# EAGLE schematic Light_Module (EAGLE 6.4)

## Sheet 1 of 2
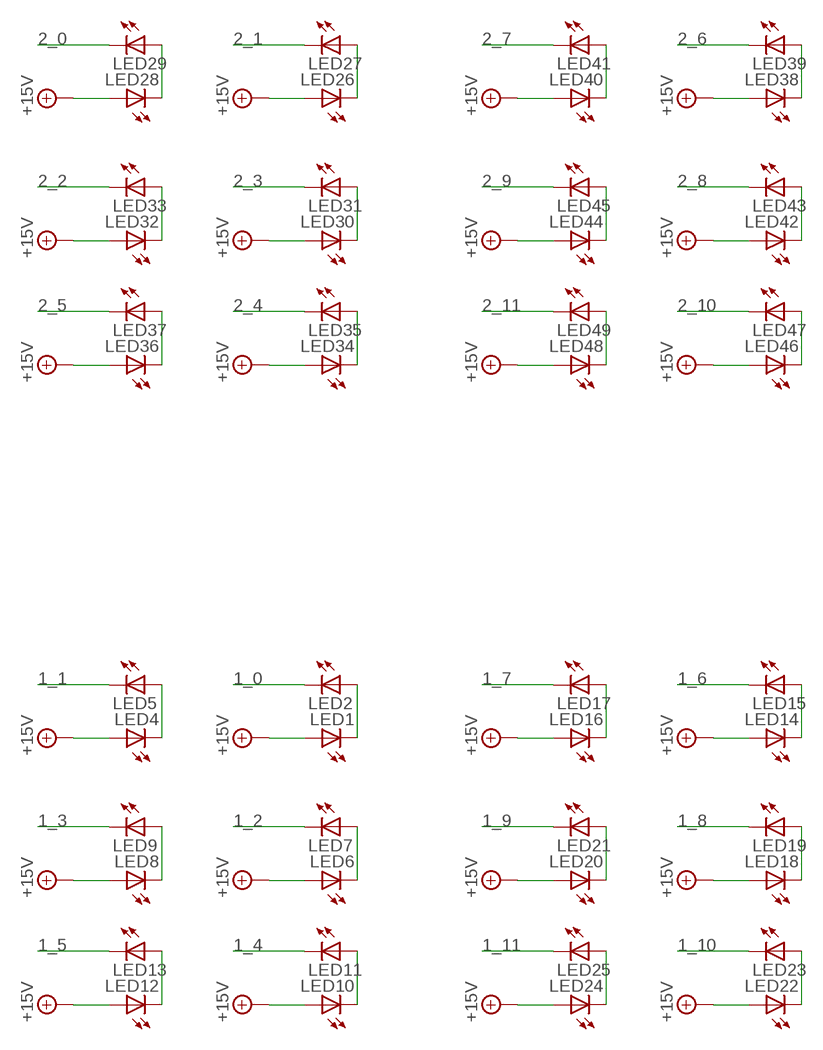
[diagram p0: schematic, sheet 1]

### Parts
LED1  LED  [DS205]
LED2  LED  [DS205]
LED4  LED  [DS205]
LED5  LED  [DS205]
LED6  LED  [DS205]
LED7  LED  [DS205]
LED8  LED  [DS205]
LED9  LED  [DS205]
LED10  LED  [DS205]
LED11  LED  [DS205]
LED12  LED  [DS205]
LED13  LED  [DS205]
LED14  LED  [DS205]
LED15  LED  [DS205]
LED16  LED  [DS205]
LED17  LED  [DS205]
LED18  LED  [DS205]
LED19  LED  [DS205]
LED20  LED  [DS205]
LED21  LED  [DS205]
LED22  LED  [DS205]
LED23  LED  [DS205]
LED24  LED  [DS205]
LED25  LED  [DS205]
LED26  LED  [DS205]
LED27  LED  [DS205]
LED28  LED  [DS205]
LED29  LED  [DS205]
LED30  LED  [DS205]
LED31  LED  [DS205]
LED32  LED  [DS205]
LED33  LED  [DS205]
LED34  LED  [DS205]
LED35  LED  [DS205]
LED36  LED  [DS205]
LED37  LED  [DS205]
LED38  LED  [DS205]
LED39  LED  [DS205]
LED40  LED  [DS205]
LED41  LED  [DS205]
LED42  LED  [DS205]
LED43  LED  [DS205]
LED44  LED  [DS205]
LED45  LED  [DS205]
LED46  LED  [DS205]
LED47  LED  [DS205]
LED48  LED  [DS205]
LED49  LED  [DS205]

### Nets
1_0: LED2.P$2(C) ; also sheet 2
1_1: LED5.P$2(C) ; also sheet 2
1_2: LED7.P$2(C) ; also sheet 2
1_3: LED9.P$2(C) ; also sheet 2
1_4: LED11.P$2(C) ; also sheet 2
1_5: LED13.P$2(C) ; also sheet 2
1_6: LED15.P$2(C) ; also sheet 2
1_7: LED17.P$2(C) ; also sheet 2
1_8: LED19.P$2(C) ; also sheet 2
1_9: LED21.P$2(C) ; also sheet 2
1_10: LED23.P$2(C) ; also sheet 2
1_11: LED25.P$2(C) ; also sheet 2
2_0: LED29.P$2(C) ; also sheet 2
2_1: LED27.P$2(C) ; also sheet 2
2_2: LED33.P$2(C) ; also sheet 2
2_3: LED31.P$2(C) ; also sheet 2
2_4: LED35.P$2(C) ; also sheet 2
2_5: LED37.P$2(C) ; also sheet 2
2_6: LED39.P$2(C) ; also sheet 2
2_7: LED41.P$2(C) ; also sheet 2
2_8: LED43.P$2(C) ; also sheet 2
2_9: LED45.P$2(C) ; also sheet 2
2_10: LED47.P$2(C) ; also sheet 2
2_11: LED49.P$2(C) ; also sheet 2
+15V: LED1.P$1(A) LED4.P$1(A) LED6.P$1(A) LED8.P$1(A) LED10.P$1(A) LED12.P$1(A) LED14.P$1(A) LED16.P$1(A) LED18.P$1(A) LED20.P$1(A) LED22.P$1(A) LED24.P$1(A) LED26.P$1(A) LED28.P$1(A) LED30.P$1(A) LED32.P$1(A) LED34.P$1(A) LED36.P$1(A) LED38.P$1(A) LED40.P$1(A) LED42.P$1(A) LED44.P$1(A) LED46.P$1(A) LED48.P$1(A) ; also sheet 2
N$5: LED1.P$2(C) LED2.P$1(A)
N$9: LED4.P$2(C) LED5.P$1(A)
N$10: LED6.P$2(C) LED7.P$1(A)
N$11: LED8.P$2(C) LED9.P$1(A)
N$12: LED10.P$2(C) LED11.P$1(A)
N$13: LED12.P$2(C) LED13.P$1(A)
N$14: LED14.P$2(C) LED15.P$1(A)
N$15: LED16.P$2(C) LED17.P$1(A)
N$16: LED18.P$2(C) LED19.P$1(A)
N$17: LED20.P$2(C) LED21.P$1(A)
N$18: LED22.P$2(C) LED23.P$1(A)
N$19: LED24.P$2(C) LED25.P$1(A)
N$20: LED26.P$2(C) LED27.P$1(A)
N$21: LED28.P$2(C) LED29.P$1(A)
N$22: LED30.P$2(C) LED31.P$1(A)
N$23: LED32.P$2(C) LED33.P$1(A)
N$24: LED34.P$2(C) LED35.P$1(A)
N$25: LED36.P$2(C) LED37.P$1(A)
N$26: LED38.P$2(C) LED39.P$1(A)
N$27: LED40.P$2(C) LED41.P$1(A)
N$28: LED42.P$2(C) LED43.P$1(A)
N$29: LED44.P$2(C) LED45.P$1(A)
N$30: LED46.P$2(C) LED47.P$1(A)
N$31: LED48.P$2(C) LED49.P$1(A)

## Sheet 2 of 2
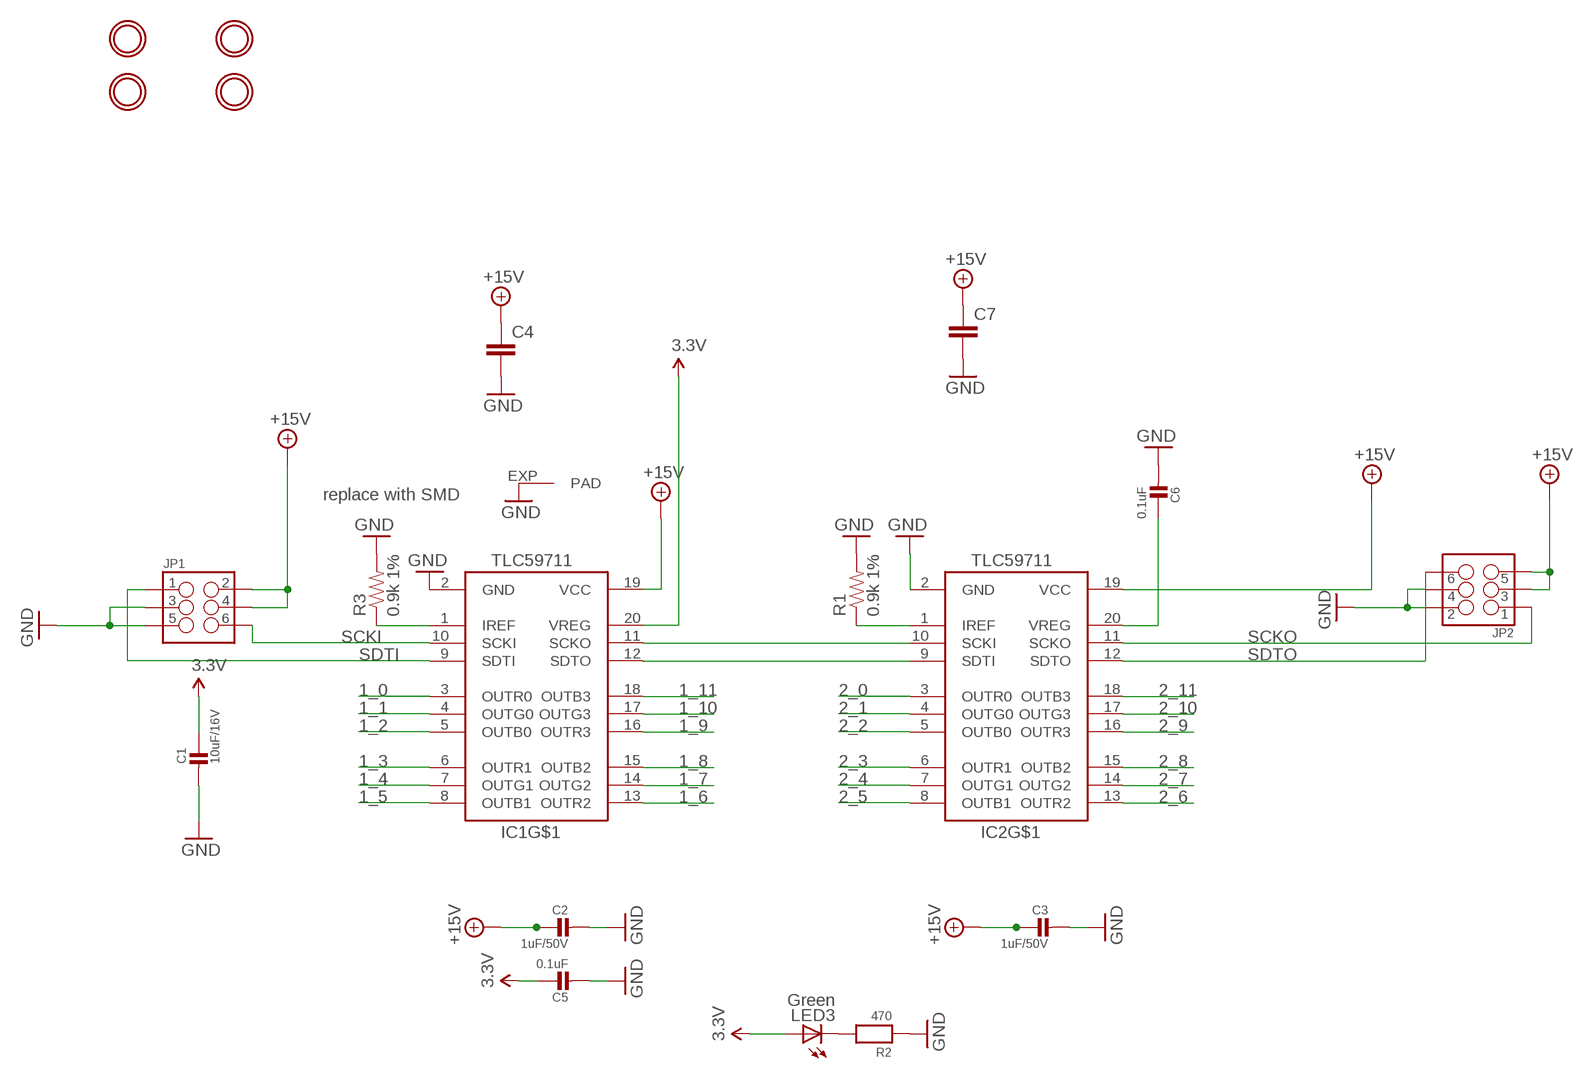
[diagram p1: schematic, sheet 2]

### Parts
C1  10uF/16V  CAP_CERAMIC0805  [0805]
C2  1uF/50V  CAP_CERAMIC0805  [0805]
C3  1uF/50V  CAP_CERAMIC0805  [0805]
C4  CAP1206  [1206]
C5  0.1uF  CAP_CERAMIC0805  [0805]
C6  0.1uF  CAP_CERAMIC0805  [0805]
C7  CAP_  [AXIAL-5MM]
IC1  TLC59711  [HTSSOP20DAP]
IC2  TLC59711  [HTSSOP20DAP]
JP1  M03X2FEMALE_SMD  [2X3_SMD]
JP2  M03X2FEMALE_SMD  [2X3_SMD]
LED3  Green  LEDCHIP-LED0805  [CHIP-LED0805]
R1  0.9k 1%  RESISTOR1206  [1206]
R2  470  RESISTOR0805  [0805]
R3  0.9k 1%  RESISTOR1206  [1206]
U$1  MOUNTINGHOLE2.5  [MOUNTINGHOLE_2.5_PLATED]
U$2  MOUNTINGHOLE2.5  [MOUNTINGHOLE_2.5_PLATED]
U$3  MOUNTINGHOLE2.5  [MOUNTINGHOLE_2.5_PLATED]
U$4  MOUNTINGHOLE2.5  [MOUNTINGHOLE_2.5_PLATED]

### Nets
1_0: IC1.3(OUTR0) ; also sheet 1
1_1: IC1.4(OUTG0) ; also sheet 1
1_2: IC1.5(OUTB0) ; also sheet 1
1_3: IC1.6(OUTR1) ; also sheet 1
1_4: IC1.7(OUTG1) ; also sheet 1
1_5: IC1.8(OUTB1) ; also sheet 1
1_6: IC1.13(OUTR2) ; also sheet 1
1_7: IC1.14(OUTG2) ; also sheet 1
1_8: IC1.15(OUTB2) ; also sheet 1
1_9: IC1.16(OUTR3) ; also sheet 1
1_10: IC1.17(OUTG3) ; also sheet 1
1_11: IC1.18(OUTB3) ; also sheet 1
2_0: IC2.3(OUTR0) ; also sheet 1
2_1: IC2.4(OUTG0) ; also sheet 1
2_2: IC2.5(OUTB0) ; also sheet 1
2_3: IC2.6(OUTR1) ; also sheet 1
2_4: IC2.7(OUTG1) ; also sheet 1
2_5: IC2.8(OUTB1) ; also sheet 1
2_6: IC2.13(OUTR2) ; also sheet 1
2_7: IC2.14(OUTG2) ; also sheet 1
2_8: IC2.15(OUTB2) ; also sheet 1
2_9: IC2.16(OUTR3) ; also sheet 1
2_10: IC2.17(OUTG3) ; also sheet 1
2_11: IC2.18(OUTB3) ; also sheet 1
3.3V: C1.1 C5.1 IC1.20(VREG) LED3.A
+15V: C2.1 C3.1 C4.1 C7.P$1 IC1.19(VCC) IC2.19(VCC) JP1.2 JP1.4 JP2.3 JP2.5 ; also sheet 1
GND: C1.2 C2.2 C3.2 C4.2 C5.2 C6.2 C7.P$2 IC1.2(GND) IC1.EXP(PAD) IC2.2(GND) JP1.3 JP1.5 JP2.2 JP2.4 R1.2 R2.1 R3.2
N$1: LED3.C R2.2
N$2: IC1.1(IREF) R3.1
N$3: IC2.1(IREF) R1.1
N$4: IC1.11(SCKO) IC2.10(SCKI)
N$6: IC1.12(SDTO) IC2.9(SDTI)
N$7: C6.1 IC2.20(VREG)
SCKI: IC1.10(SCKI) JP1.6
SCKO: IC2.11(SCKO) JP2.1
SDTI: IC1.9(SDTI) JP1.1
SDTO: IC2.12(SDTO) JP2.6
Unconnected: IC2.EXP(PAD)

### Notes on the sheet
- replace with SMD

## Library data of the parts
C1-C3 C5 C6 = microbuilder:CAP_CERAMIC: Ceramic Capacitors For new designs, use the packages preceded by an '_' character since they are more reliable: The following footprints should be used on most boards: _0402 - Standard footprint for regular board layouts _0603 - Standard footprint for regular board layouts _0805 - Standard footprint for regular board layouts For extremely tight-pitch boards where space is at a premium, the following 'micro-pitch' footprints can be used (smaller pads, no silkscreen outline, etc.): _0402MP - Micro-pitch footprint for very dense/compact boards _0603MP - Micro-pitch footprint for very dense/compact boards _0805MP - Micro-pitch footprint for very dense/compact boards Commonly Stocked Parts 0402 - 0402 Surface Mount Capacitors 16pF 50V 5% [Digikey: 445-4899-2-ND] 18pF 50V 5% [Digikey: 490-1281-2-ND] 22pF 50V 5% [Digikey: 490-1283-2-ND] 68pF 50V 5% [Digikey: 490-1289-2-ND] 0.1uF 10V 10% [Digikey: 490-1318-2-ND] 1.0uF 6.3V 10% [Digikey: 490-1320-2-ND] 0603 - 0603 Surface Mount Capacitors 16 pF 50V 5% [Digikey: 445-5051-2-ND] 22 pF 50V [Digikey: PCC220ACVTR-ND] 33 pF 50V 5% [Digikey: 490-1415-1-ND] 56pF 50V 5% [Digikey: 490-1421-1-ND] 220pF 50V 5% [Digikey: 445-1285-1-ND] 680 pF 50V 2200 pF 50V 5% C0G [Digikey: 445-1297-1-ND] 5600 pF 100V 5% X7R [Digikey: 478-3711-1-ND] 0.1 µF 25V 10% [Digikey: PCC2277TR-ND] 0.22 µF 16V 10% X7R [Digikey: 445-1318-1-ND] 1.0 µF 25V 10% [Digikey: 445-5146-2-ND] 0603 - RF Specific 3pF 250V +/-0.1pF RF [Digikey: 712-1347-1-ND] 18 pF 250V 5% [Digikey: 478-3505-1-ND or 712-1322-1-ND] 56 pF 250V 5% C0G RF [Digikey: 490-4867-1-ND] 68 pF 250V RF [Digikey: 490-4868-1-ND] 0805 - 0805 Surface Mount Capacitors 220 pF 250V 2% RF Ceramic Capacitor [Digikey: 712-1398-1-ND] 1000 pF 50V 2% NP0 Ceramic Capacitor [Digikey: 478-3760-1-ND] 0.1 µF 25V 10% Ceramic Capacitor [Digikey: PCC1828TR-ND] 1.0 µF 16V 10% Ceramic Capacitor[Digikey: 490-1691-2-ND] 10.0 µF 10V 10% Ceramic Capacitor[Digikey: 709-1228-1-ND] 10.0 uF 16V 10% Ceramic Capacitor [Digikey: 478-5165-2-ND] 47 uF 6.3V 20% Ceramic Capacitor [Digikey: 587-1779-1-ND or 399-5506-1-ND] 1206 - 1206 Surface Mount Capacitors 47uF 10V 20% Ceramic Capacitor [Digikey: 490-5528-1-ND or 399-5508-1-ND or 445-6010-1-ND] 100uF 6.3V -20%, +80% Y5V Ceramic Capacitor (Digikey: 490-4512-1-ND, Mouser: 81-GRM31CF50J107ZE1L)
C4 C7 = SparkFun-Passives:CAP: Capacitor Standard 0603 ceramic capacitor, and 0.1" leaded capacitor.
IC1 IC2 = adafruit:TLC59711
JP1 JP2 = SparkFun-Connectors:M03X2: 2x3 .1" header. Shrouded, with keying- CONN-10681 SMT- CONN-11415 Pogo pins- HW-11044; PROD_ID: CONN-11290
LED1 LED2 LED4-LED49 = digikey:LED
LED3 = adafruit:LED: LED OSRAM: - CHIPLED LG R971, LG N971, LY N971, LG Q971, LY Q971, LO R971, LY R971 LH N974, LH R974 LS Q976, LO Q976, LY Q976 LO Q996 - Hyper CHIPLED LW Q18S LB Q993, LB Q99A, LB R99A - SideLED LS A670, LO A670, LY A670, LG A670, LP A670 LB A673, LV A673, LT A673, LW A673 LH A674 LY A675 LS A676, LA A676, LO A676, LY A676, LW A676 LS A679, LY A679, LG A679 - Hyper Micro SIDELED® LS Y876, LA Y876, LO Y876, LY Y876 LT Y87S - SmartLED LW L88C, LW L88S LB L89C, LB L89S, LG L890 LS L89K, LO L89K, LY L89K LS L896, LA L896, LO L896, LY L896 - TOPLED LS T670, LO T670, LY T670, LG T670, LP T670 LSG T670, LSP T670, LSY T670, LOP T670, LYG T670 LG T671, LOG T671, LSG T671 LB T673, LV T673, LT T673, LW T673 LH T674 LS T676, LA T676, LO T676, LY T676, LB T676, LH T676, LSB T676, LW T676 LB T67C, LV T67C, LT T67C, LS T67K, LO T67K, LY T67K, LW E67C LS E67B, LA E67B, LO E67B, LY E67B, LB E67C, LV E67C, LT E67C LW T67C LS T679, LY T679, LG T679 LS T770, LO T770, LY T770, LG T770, LP T770 LB T773, LV T773, LT T773, LW T773 LH T774 LS E675, LA E675, LY E675, LS T675 LS T776, LA T776, LO T776, LY T776, LB T776 LHGB T686 LT T68C, LB T68C - Hyper Mini TOPLED® LB M676 - Mini TOPLED Santana® LG M470 LS M47K, LO M47K, LY M47K Source: http://www.osram.convergy.de/
R1 R3 = SparkFun-Passives:RESISTOR: Resistor Basic schematic elements and footprints for 0603, 1206, and PTH resistors.
R2 = microbuilder:RESISTOR: Resistors For new designs, use the packages preceded by an '_' character since they are more reliable: The following footprints should be used on most boards: _0402 - Standard footprint for regular board layouts _0603 - Standard footprint for regular board layouts _0805 - Standard footprint for regular board layouts For extremely tight-pitch boards where space is at a premium, the following 'micro-pitch' footprints can be used (smaller pads, no silkscreen outline, etc.): _0402MP - Micro-pitch footprint for very dense/compact boards _0603MP - Micro-pitch footprint for very dense/compact boards _0805MP - Micro-pitch footprint for very dense/compact boards
U$1-U$4 = microbuilder:MOUNTINGHOLE: Mounting Hole For #2 screws (0.086"/2.18mm width, 0.094"/2.4mm hole) use 2.5mm